# EAGLE design GarageDoor (EAGLE 7.5.0)
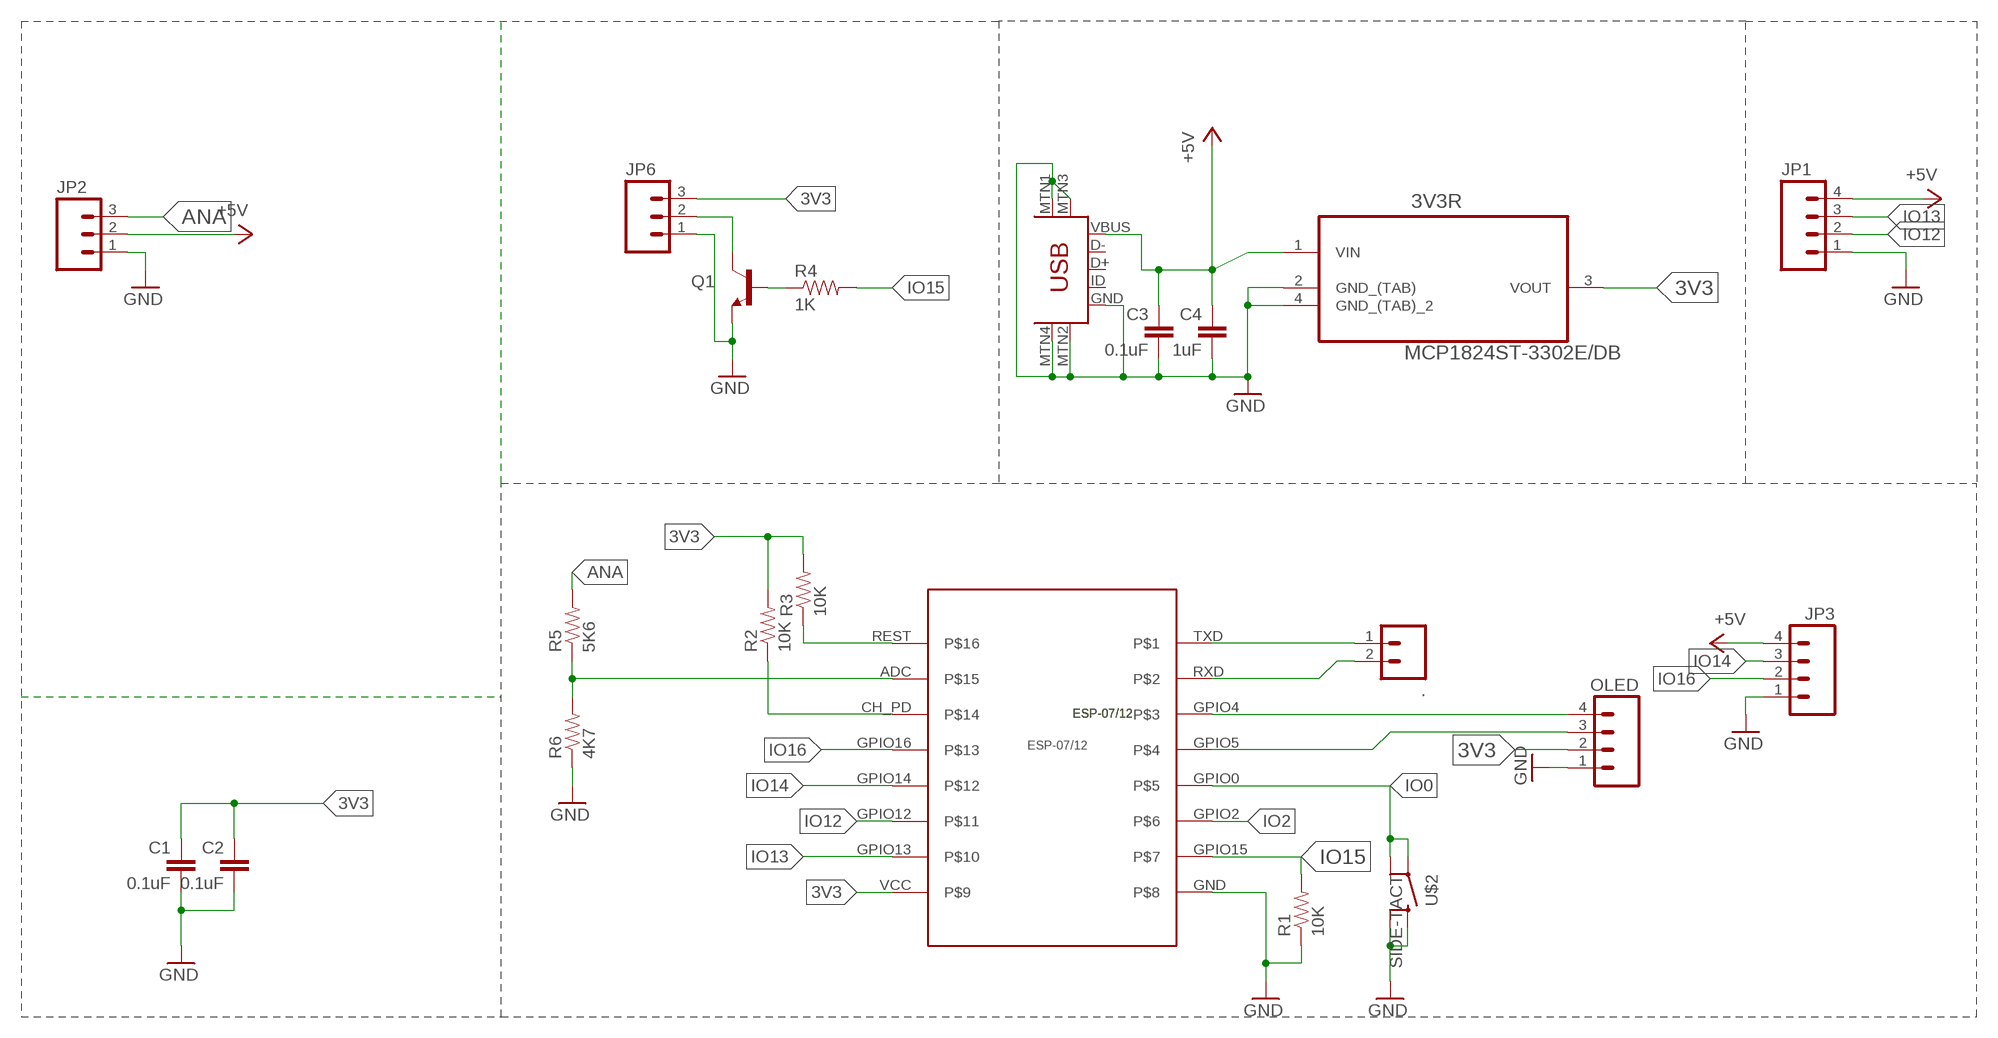
[diagram p0: schematic, sheet 1]

## Parts
3V3R  MCP1824ST-3302E/DB  [SOT230P700X180-4N]
.  M02PTH  [1X02]
C1  0.1uF  CAP  [0805-CAP]
C2  0.1uF  CAP  [0805-CAP]
C3  0.1uF  CAP  [0805-CAP]
C4  1uF  CAP  [0805-CAP]
JP1  M04POLAR  [MOLEX-1X4]
JP2  M03POLAR  [MOLEX-1X3]
JP3  M04POLAR  [MOLEX-1X4]
JP6  M03POLAR  [MOLEX-1X3]
OLED  M04PTH  [1X04]
Q1  TRANSISTOR_NPNSOT23-3  [SOT23-3]
R1  10K  RESISTOR0805-RES  [0805]
R2  10K  RESISTOR0805-RES  [0805]
R3  10K  RESISTOR0805-RES  [0805]
R4  1K  RESISTOR0805-RES  [0805]
R5  5K6  RESISTOR0805-RES  [0805]
R6  4K7  RESISTOR0805-RES  [0805]
U$1  ESP-07/12  [ESP-07/12]
U$2  SIDE-TACT  [SIDE-TACT]
U$4  USB-MINIB-5PIN  [USB-MINIB]

## Nets
3V3: 3V3R.3(VOUT) C1.1 C2.1 JP6.3 OLED.2 R2.2 R3.2 U$1.VCC
+5V: 3V3R.1(VIN) C3.1 C4.1 JP1.4 JP2.2 JP3.4 U$4.VBUS
ADC: R5.1 R6.2 U$1.ADC
ANA: JP2.3 R5.2
GND: 3V3R.2(GND_(TAB)) 3V3R.4(GND_(TAB)_2) C1.2 C2.2 C3.2 C4.2 JP1.1 JP2.1 JP3.1 JP6.1 OLED.1 Q1.2(E) R1.1 R6.1 U$1.GND U$2.3 U$2.4 U$4.GND U$4.MTN1(MTN2) U$4.MTN2(MTN3) U$4.MTN3(MTN1) U$4.MTN4
ICSPCLK: R3.1 U$1.REST
IO0: U$1.GPIO0 U$2.1 U$2.2
IO2: U$1.GPIO2
IO12: JP1.2 U$1.GPIO12
IO13: JP1.3 U$1.GPIO13
IO14: JP3.3 U$1.GPIO14
IO15: R1.2 R4.2 U$1.GPIO15
IO16: JP3.2 U$1.GPIO16
N$1: JP6.2 Q1.3(C)
N$3: OLED.4 U$1.GPIO4
N$7: OLED.3 U$1.GPIO5
N$8: Q1.1(B) R4.1
N$11: R2.1 U$1.CH_PD
RXD: ..2 U$1.RXD
TXD: ..1 U$1.TXD
Unconnected: U$4.D+ U$4.D- U$4.ID

## Library data of the parts
3V3R = Microchip_By_element14_Batch_1:MCP1824ST-3302E/DB: IC, LDO VOLT REG, 3.3V, 0.3A,; MPN: MCP1824ST-3302E/DB; OC_FARNELL: 1578379; OC_NEWARK: 05N1293; PACKAGE: SOT-223-3; SUPPLIER: Microchip
. = SparkFun-Connectors:M02: Standard 2-pin 0.1" header. Use with - straight break away headers ( PRT-00116) - right angle break away headers (PRT-00553) - swiss pins (PRT-00743) - machine pins (PRT-00117) - female headers (PRT-00115) Molex polarized connector foot print use with: PRT-08233 with associated crimp pins and housings. 2.54_SCREWTERM for use with PRT-10571. 3.5mm Screw Terminal footprints for PRT-08084 5mm Screw Terminal footprints for use with PRT-08432
C1-C4 = SparkFun-Capacitors:CAP: Capacitor Standard 0603 ceramic capacitor, and 0.1" leaded capacitor.
JP1 JP3 OLED = SparkFun-Connectors:M04: Header 4 Standard 4-pin 0.1" header. Use with straight break away headers (SKU : PRT-00116), right angle break away headers (PRT-00553), swiss pins (PRT-00743), machine pins (PRT-00117), and female headers (PRT-00115). Molex polarized connector foot print use with SKU : PRT-08231 with associated crimp pins and housings. 1MM SMD Version SKU: PRT-10208
JP2 JP6 = SparkFun-Connectors:M03: Header 3 Standard 3-pin 0.1" header. Use with straight break away headers (SKU : PRT-00116), right angle break away headers (PRT-00553), swiss pins (PRT-00743), machine pins (PRT-00117), and female headers (PRT-00115). Molex polarized connector foot print use with SKU : PRT-08232 with associated crimp pins and housings.
Q1 = SparkFun-DiscreteSemi:TRANSISTOR_NPN: Generic NPN BJT MMBT2222A - TRANS-08049 (SOT-23, 1A 40V) MPSA42 - TRANS-09116 (SOT-23, 500mA 300V) MMBT5088LT1G - TRANS-11160 (SOT-23, 50 mA 30V) BC547 - COM-08928 <http://www.sparkfun.com/products/8928> (TO-92 45V 100mA) (1.Collector 2.Base 3.Emitter) 2N3904 - COM-00521 <http://www.sparkfun.com/products/521> (TO-92 40V 200mA) (1.Emitter 2.Base 3.Collector) P2N2222A - COM-12852 <http://www.sparkfun.com/products/12852> (TO-92 40V 600mA) (1.Collector 2.Base 3.Emitter); PROD_ID: TRANS-08049
R1-R6 = SparkFun-Resistors:RESISTOR: Resistor Basic schematic elements and footprints for 0603, 1206, and PTH resistors.
U$1 = ESP-07_12:ESP-07/12: Version 1.0 of the library for the ESP-07/12 full GPIO dev board module byME Jon jonnyradu@gmail.com
U$2 = CuriousTech:SIDE-TACT
U$4 = SparkFun-Connectors:USB-MINIB: Mini-USB "B" connector with 5th pin broken out. Created new symbol breaking out 5th "ID" pin in mini/micro USB connector spec. See: http://en.wikipedia.org/wiki/Mini_usb#Cables. Uses same footprint as 4-pin symbol. Also added pins to connect to mounting / shield pads if required (probably not generally needed as signals aren't shielded once they leave the connector).; PROD_ID: CONN-08193

## Board
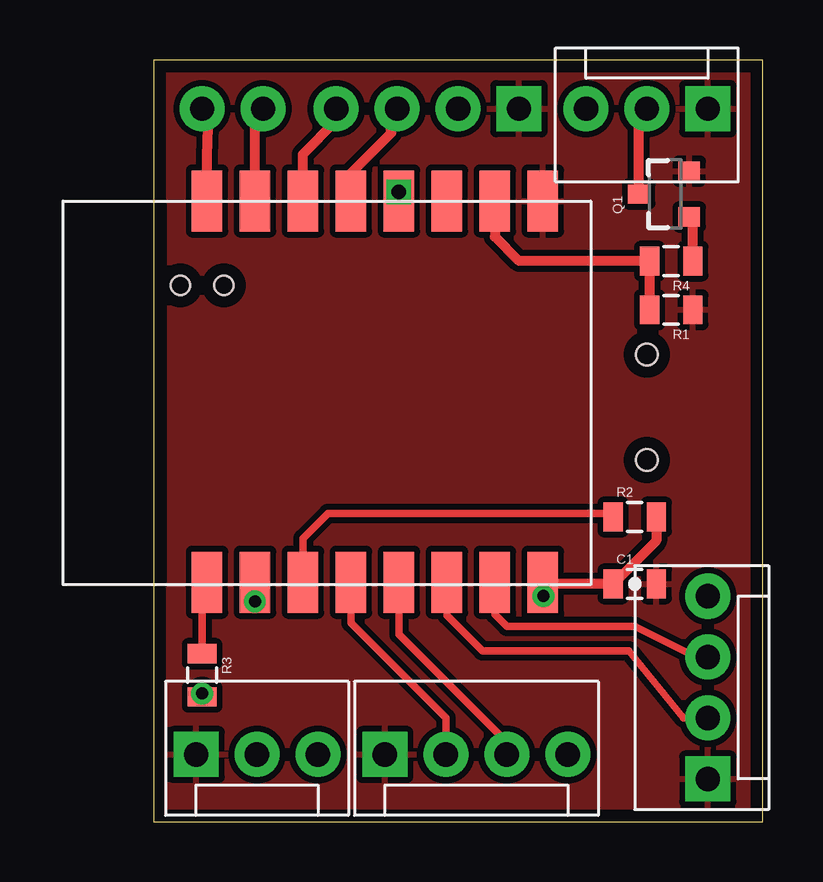
[diagram p1: board, top side]
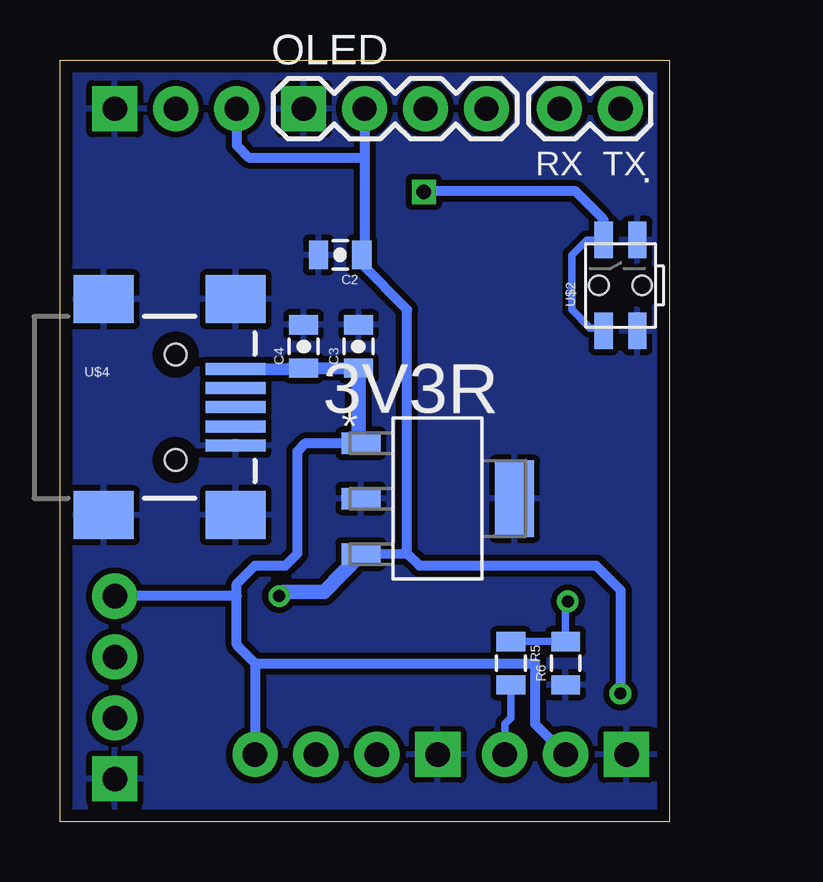
[diagram p2: board, bottom side, seen from below]

Size 25.4 x 31.75 mm. Coordinates in mm from the lower left corner, seen from the top.
Outline: 25.4,0 25.4,31.75 0,31.75 0,0 25.4,0
Copper layers (1*16): Top 0.035mm / dielectric 1.5mm / Bottom 0.035mm
Design rules "default *": minimum track width 10mil, minimum drill 24mil, track to track 8mil, track to pad 8mil, pad to pad 8mil, via to via 8mil, smd to smd 8mil, copper to edge 20mil, drill to drill 8mil, minimum pad ring 10mil, minimum via ring 8mil, stop-mask expansion 4mil, vias tented up to drill 0mil, thermal gap 10mil

### Footprints (pad centres in the part's own frame; a part is rotated, then mirrored left to right if it is on the bottom)
SOT230P700X180-4N = smd 1.626 x 0.889: 1 -3.2,2.311; 2 -3.2,0; 3 -3.2,-2.311 | smd 1.626 x 3.175: 4 3.2,0
1X02 = drill 1.016 pad 1.88: 1 0,0; 2 2.54,0
0805-CAP = smd 0.8 x 1.2: 1 -0.9,0; 2 0.9,0
MOLEX-1X4 = drill 1.016 pad 1.88 square: 1 0,0 | drill 1.016 pad 1.88: 2 2.54,0; 3 5.08,0; 4 7.62,0
MOLEX-1X3 = drill 1.016 pad 1.88 square: 1 0,0 | drill 1.016 pad 1.88: 2 2.54,0; 3 5.08,0
1X04 = drill 1.016 pad 1.88 square: 1 0,0 | drill 1.016 pad 1.88: 2 2.54,0; 3 5.08,0; 4 7.62,0
SOT23-3 = smd 0.8 x 0.9: 1 -0.95,-1; 2 0.95,-1; 3 0,1.1
0805 = smd 0.8 x 1.2: 1 -0.9,0; 2 0.9,0
ESP-07/12 = smd 2.54 x 1.27: ADC 0.1,14; CH_PD 0.1,12; GND 16,2; GPIO0 16,8; GPIO2 16,6; GPIO4 16,12; GPIO5 16,10; GPIO12 0.1,6; GPIO13 0.1,4; GPIO14 0.1,8; GPIO15 16,4; GPIO16 0.1,10; REST 0.1,16; RXD 16,14; TXD 16,16; VCC 0.1,2
SIDE-TACT = smd 1.524 x 0.762: 1 -1.894,0.705; 2 1.894,0.705; 3 -1.894,-0.705; 4 1.894,-0.705 | hole 0.8: 0,0.9; 0,-0.9
USB-MINIB = smd 2.5 x 0.5: D+ 2.5,0; D- 2.5,0.8; GND 2.5,-1.6; ID 2.5,-0.8; VBUS 2.5,1.6 | smd 2.5 x 2: MTN1 -3,4.5; MTN2 2.5,4.5; MTN3 -3,-4.5; MTN4 2.5,-4.5 | hole 0.9: 0,2.2; 0,-2.2

### Placement (x,y rotation side)
3V3R  9.65,13.46 0 bottom
.  2.03,29.72 180 bottom
C1  20.07,9.91 0 top
C2  13.72,23.62 180 bottom
C3  12.95,19.81 90 bottom
C4  15.24,19.81 90 bottom
JP1  23.11,1.78 90 top
JP2  1.78,2.79 0 top
JP3  9.65,2.79 0 top
JP6  23.11,29.72 180 top
OLED  15.24,29.72 0 bottom
Q1  21.34,26.16 90 top
R1  21.59,21.34 180 top
R2  20.07,12.7 0 top
R3  2.03,6.1 270 top
R4  21.59,23.37 180 top
R5  6.6,6.6 270 bottom
R6  4.32,6.6 90 bottom
U$1  18.23,9.87 90 top
U$2  2.03,22.35 90 bottom
U$4  20.57,17.27 0 bottom

### Tracks (layer width: path | path; a pad name or v marks a point on that pad's centre or on a via)
3V3  (via drill 0.5)
  Top 0.406: v2.03,5.33 2.29,5.45 R3.2 | R2.2 20.97,11.71 C1.1 16.29,9.91 U$1.VCC
  Top 0.61: v16.26,9.4 16.26,10 U$1.VCC
  Bottom 0.406: OLED.2 12.7,27.69 | 12.7,27.69 12.7,23.62 C2.1 12.82,23.23 10.92,21.34 10.92,11.18 | 10.92,11.18 10.41,10.67 3.05,10.67 2.03,9.65 v2.03,5.33 | 3V3R.3 12.47,11.15 10.92,11.18 | JP6.3 18.03,28.19 17.53,27.69 12.7,27.69
  Bottom 0.61: 3V3R.3 14.39,9.57 16.09,9.57 v16.26,9.4
+5V
  Bottom 0.406: 3V3R.1 15.16,15.77 15.49,15.44 15.49,11.18 16,10.67 17.27,10.67 18.03,9.91 18.03,9.4 | 17.27,6.6 5.59,6.6 5.59,4.06 JP2.2 | 17.27,6.6 18.03,7.37 18.03,9.4 | 18.03,9.4 JP1.4 | C4.1 15.41,18.91 15.88,18.87 | 17.27,6.6 JP3.4
  Bottom 0.508: U$4.VBUS 15.88,18.87 | C4.1 C3.1
  Bottom 0.61: 3V3R.1 12.95,15.77 C3.1
ADC  (via drill 0.5)
  Top 0.406: U$1.ADC v4.23,9.17
  Bottom 0.305: v4.23,9.17 4.32,9.08 R6.2 R5.1
ANA
  Bottom 0.305: R5.2 6.6,4.32 6.86,4.06 JP2.3
GND
  pour Top (isolate 0.254): 0,0 0,31.75 25.4,31.75 25.4,0
  pour Bottom (isolate 0.254): 25.4,0 0,0 0,31.75 25.4,31.75
ICSPCLK
  Top 0.305: R3.1 2.03,8.87 | 2.29,10.16 2.03,8.87 | 2.03,8.87 2.26,10.62
  Top 0.406: 2.26,10.62 2.32,10.17 2.23,10.17 U$1.REST | U$1.REST 2.23,10.89 | U$1.REST 2.23,9.87
IO0  (via drill 0.6)
  Top 0.305: U$1.GPIO0 v10.23,26.25 10.41,25.42
  Bottom 0.305: U$2.2 3.44,24.25 4.06,23.62 4.06,21.34 3.3,20.57 2.85,20.57 U$2.1
  Bottom 0.406: U$2.2 2.74,25.09 2.79,25.15 3.91,26.28 9.79,26.28 10.16,26.16 v10.23,26.25
IO12
  Top 0.305: U$1.GPIO12 12.23,8.6 13.72,7.11 19.81,7.11 22.1,4.32 JP1.2
IO13
  Top 0.305: U$1.GPIO13 14.23,8.63 14.73,8.13 20.07,8.13 22.61,6.86 JP1.3
IO14
  Top 0.305: JP3.3 14.73,3.3 10.23,7.8 U$1.GPIO14
  Top 0.406: 10.16,10.41 10.04,10.16 U$1.GPIO14
IO15
  Top 0.406: R1.2 R4.2 15.24,23.37 14.23,24.38 U$1.GPIO15
IO16
  Top 0.305: U$1.GPIO16 8.23,8.28 12.19,4.32 JP3.2
N$1
  Top 0.406: Q1.3 20.24,28.87 20.32,28.96 JP6.2
N$3
  Top 0.406: U$1.GPIO4 6.23,27.82 7.62,29.21 OLED.4
N$7
  Top 0.406: U$1.GPIO5 8.23,27.03 9.91,28.7 9.91,29.72 OLED.3
N$8
  Top 0.406: R4.1 22.49,25.21 Q1.1
N$11
  Top 0.305: U$1.CH_PD 6.23,11.79 7.28,12.85 19.27,12.85 R2.1
  Top 0.406: 6.29,9.97 U$1.CH_PD
RXD
  Top 0.406: U$1.RXD 4.23,29.04 ..2
TXD
  Top 0.406: U$1.TXD 2.23,27.74 2.29,28.96 ..1

### Text on the board
bPlace: RX TX
tStop: ESP-07/12
bStop: CuriousTech.net